# Altium schematic sheet МПСУ.464342.21-005Э3 Лист5.SchDoc
size 297 x 209 mm; Address1: Address1; Address2: Address2; Address3: Address3; Address4: Address4; SheetNumber: 1; SheetTotal: 5; Scale: 1:1; Обозначение документа: МПСУ.464342.21-005 Э3; Номер листа: 5
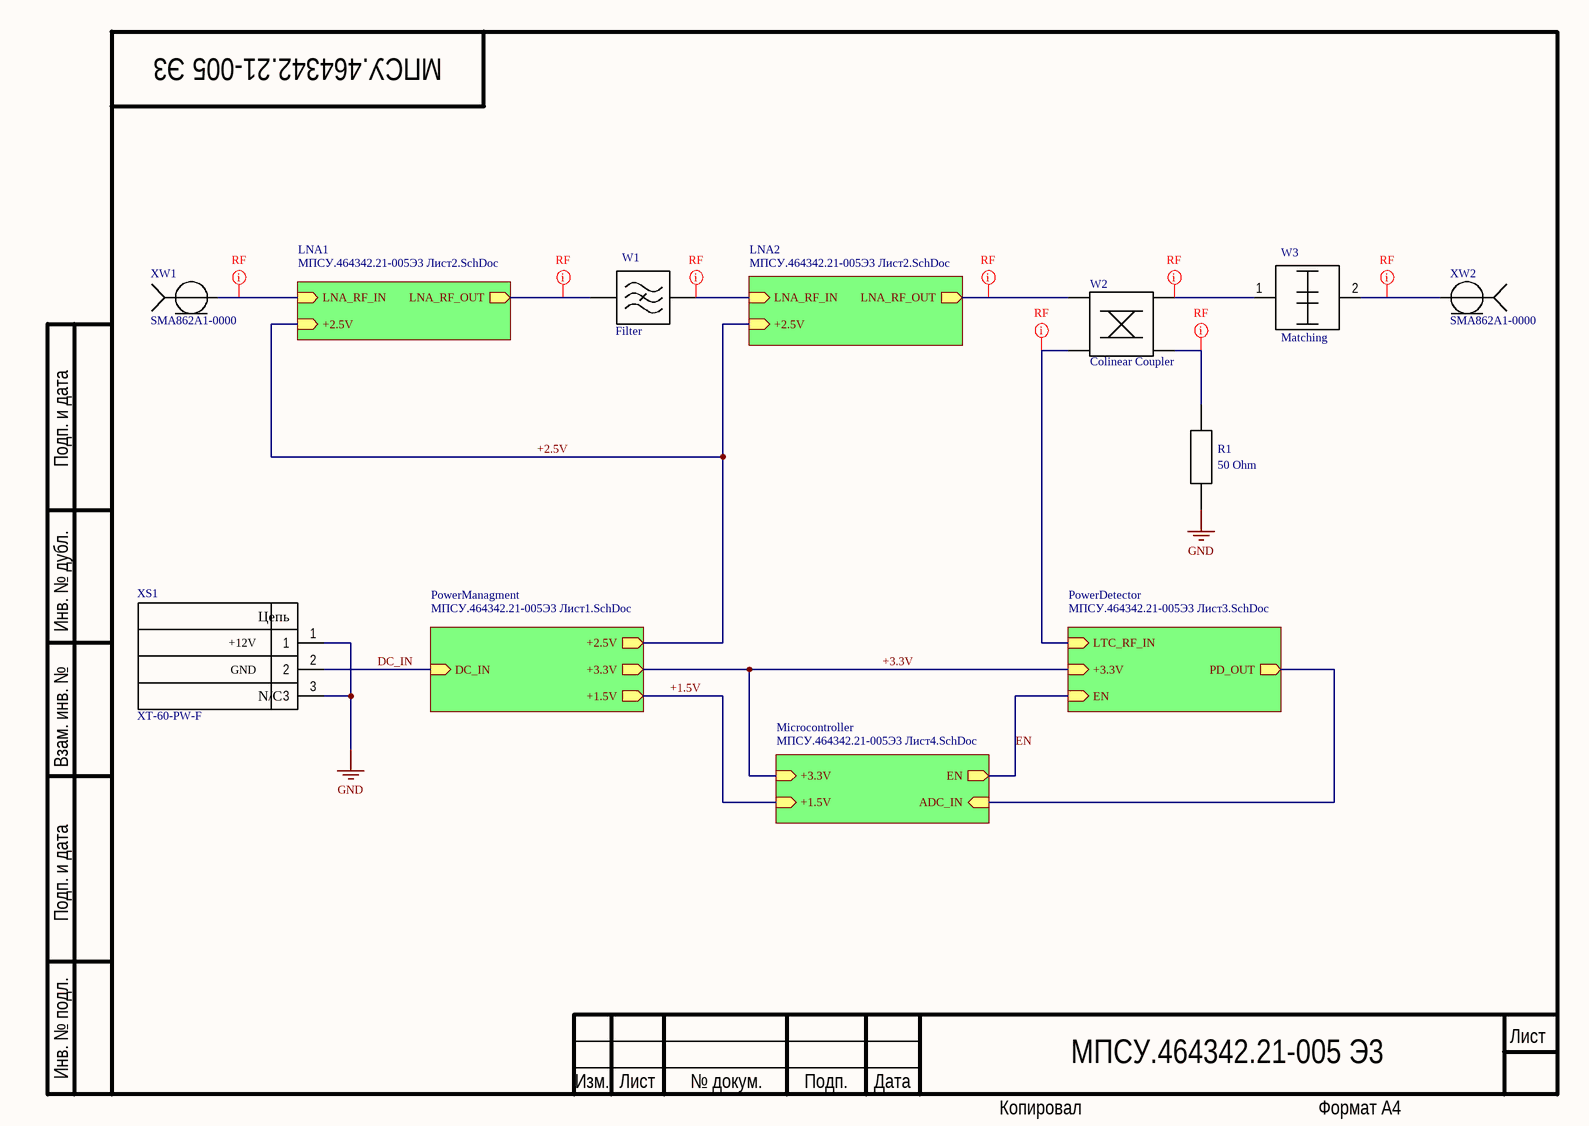
[diagram p0: МПСУ.464342.21-005Э3 Лист5.SchDoc]

## Parts
R1  50 Ohm  [RESC160X80X60L30N]
W1  Filter  [MFilter8_5G]  (net tie, no BOM)
W2  Colinear Coupler  [CLCoupler]  (net tie, no BOM)
W3  Matching  [MATCHING_MAIN_OUT]  (net tie, no BOM)
XS1  XT-60-PW-F  Net2: GND  Net1: +12V  [XT-60-PW-F]
XW1  SMA862A1-0000  [SMA862A1-0000]
XW2  SMA862A1-0000  [SMA862A1-0000]

## Sub-sheets
LNA1 = МПСУ.464342.21-005Э3 Лист2.SchDoc: +2.5V (in), LNA_RF_IN (in), LNA_RF_OUT (out)
LNA2 = МПСУ.464342.21-005Э3 Лист2.SchDoc: +2.5V (in), LNA_RF_IN (in), LNA_RF_OUT (out)
Microcontroller = МПСУ.464342.21-005Э3 Лист4.SchDoc: +1.5V (in), +3.3V (in), EN (out), ADC_IN (in)
PowerDetector = МПСУ.464342.21-005Э3 Лист3.SchDoc: LTC_RF_IN (in), +3.3V (in), EN (in), PD_OUT (out)
PowerManagment = МПСУ.464342.21-005Э3 Лист1.SchDoc: DC_IN (in), +2.5V (out), +3.3V (out), +1.5V (out)

## Nets
GND: R1.1 XS1.1 XS1.3
+1.5V: sheet PowerManagment/+1.5V, sheet Microcontroller/+1.5V
+2.5V: sheet LNA2/+2.5V, sheet LNA1/+2.5V, sheet PowerManagment/+2.5V
+3.3V: sheet PowerManagment/+3.3V, sheet Microcontroller/+3.3V, sheet PowerDetector/+3.3V
DC_IN: XS1.2 ; sheet PowerManagment/DC_IN
EN: sheet Microcontroller/EN, sheet PowerDetector/EN
NetR1_2: R1.2 W2.3
NetW1_1: W1.1 ; sheet LNA1/LNA_RF_OUT
NetW1_2: W1.2 ; sheet LNA2/LNA_RF_IN
NetW2_1: W2.1 ; sheet LNA2/LNA_RF_OUT
NetW2_2: W2.2 W3.1
NetW2_4: W2.4 ; sheet PowerDetector/LTC_RF_IN
NetW3_2: W3.2 XW2.1
NetXW1_1: XW1.1 ; sheet LNA1/LNA_RF_IN
(unnamed): sheet Microcontroller/ADC_IN, sheet PowerDetector/PD_OUT

## Layout directives
net class RF: NetR1_2, NetW1_1, NetW1_2, NetW2_1, NetW2_2, NetW2_4, NetW3_2, NetXW1_1

## Notes on the sheet
- Подп. и дата
- Инв. № дубл.
- Взам. инв. №
- Инв. № подл.
- Изм.
- Лист
- № докум.
- Подп.
- Дата
- Копировал
- Формат А4
- (in symbol XT-60-PW-F) Цепь; N/C

## Library data of the parts
R1 = Resistor: Resistor, generic; Power: 5 W; DCV: 50 V; Value: 50 Ohm; PartNumber: *; Tolerance: *; Manufacturer: *; Package: 0603
W1 = Filter 8.5G: Bandpass filter, Fc 8.50GHz, BW  500 MHz, type - Coupled Microstrip Filter, diel RO4003 0.5 oz ED 20 mil
W2 = CLCoupler: Coupler 40 dB, diel RO4003 0.5 oz ED 20 mil
W3 = Matching_1
XS1 = XT-60-PW-F: Header, Right-angle, 2x1; Manufactorer: Changzhou Amass Electronics CO.LTD.; PartNumber: XT-60-PW-F; ComponentLink1Description: DataSheet; ComponentLink1URL: https://www.tme.eu/ru/Document/9b8d0c5eb7094295f3d3112c214d3ade/XT60PW%20SPEC.pdf; Category: Connector
XW1 XW2 = SMA862A1-0000: SMA Jack For Panel Receptacle 50Ohm JYEBAO; PartNumber: SMA862A1-0000